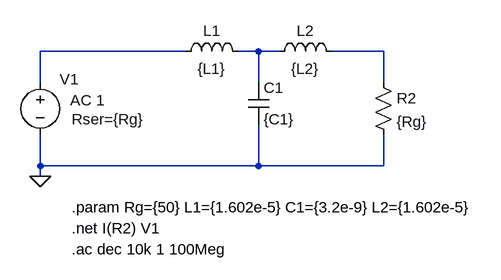
[diagram p0: schematic TS13_1Meg.asc]
TS13_1Meg.asc, the LTspice schematic file:
Version 4
SHEET 1 880 680
WIRE 320 64 96 64
WIRE 432 64 400 64
WIRE 464 64 432 64
WIRE 624 64 544 64
WIRE 96 112 96 64
WIRE 432 112 432 64
WIRE 624 112 624 64
WIRE 96 240 96 192
WIRE 432 240 432 176
WIRE 432 240 96 240
WIRE 624 240 624 192
WIRE 624 240 432 240
WIRE 96 256 96 240
FLAG 96 256 0
SYMBOL voltage 96 96 R0
WINDOW 0 30 11 Left 2
WINDOW 123 46 43 Left 2
WINDOW 39 48 72 Left 2
SYMATTR InstName V1
SYMATTR Value ""
SYMATTR Value2 AC 1
SYMATTR SpiceLine Rser={Rg}
SYMBOL ind 304 80 R270
WINDOW 0 32 56 VTop 2
WINDOW 3 5 56 VBottom 2
SYMATTR InstName L1
SYMATTR Value {L1}
SYMBOL cap 416 112 R0
SYMATTR InstName C1
SYMATTR Value {C1}
SYMBOL ind 448 80 R270
WINDOW 0 32 56 VTop 2
WINDOW 3 5 56 VBottom 2
SYMATTR InstName L2
SYMATTR Value {L2}
SYMBOL res 608 96 R0
SYMATTR InstName R2
SYMATTR Value {Rg}
TEXT 144 304 Left 2 !.param Rg={50} L1={1.602e-5} C1={3.2e-9} L2={1.602e-5}
TEXT 144 336 Left 2 !.net I(R2) V1
TEXT 144 368 Left 2 !.ac dec 10k 1 100Meg

The netlist it stands for:
* TS13_1Meg.asc
V1 N001 0 AC 1 Rser={Rg}
L1 N001 N002 {L1}
C1 N002 0 {C1}
L2 N002 N003 {L2}
R2 N003 0 {Rg}
.param Rg={50} L1={1.602e-5} C1={3.2e-9} L2={1.602e-5}
.net I(R2) V1
.ac dec 10k 1 100Meg
.backanno
.end